# Altium schematic sheet ProstheticController.SchDoc
size A
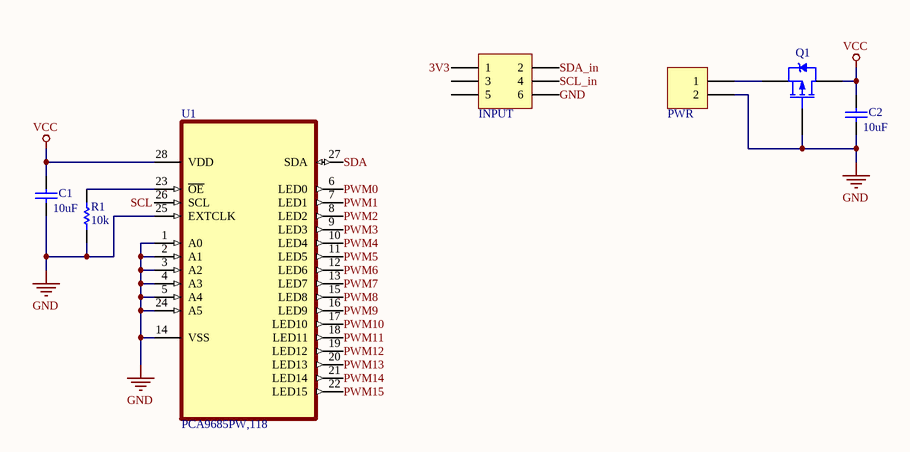
[diagram p0: ProstheticController.SchDoc]

## Parts
C1  10uF  [0805]
C2  10uF  [0805]
INPUT  90131-0123  [HDR2X3]  (value not drawn)
PWR  90120-0122  [HDR1X2]  (value not drawn)
Q1  FQP27P06  [TO-220]  (value not drawn)
R1  10k  [0805_RES_HD]
U1  PCA9685PW,118  [SOP65P640X110-28N]

## Nets
GND: C1.1 C2.1 INPUT.6 PWR.2 Q1.1(G) R1.1 U1.1(A0) U1.2(A1) U1.3(A2) U1.4(A3) U1.5(A4) U1.14(VSS) U1.24(A5) U1.25(EXTCLK)
VCC: C1.2 C2.2 Q1.2(D) U1.28(VDD)
3V3: INPUT.1
PWM0: U1.6(LED0)
PWM1: U1.7(LED1)
PWM2: U1.8(LED2)
PWM3: U1.9(LED3)
PWM4: U1.10(LED4)
PWM5: U1.11(LED5)
PWM6: U1.12(LED6)
PWM7: U1.13(LED7)
PWM8: U1.15(LED8)
PWM9: U1.16(LED9)
PWM10: U1.17(LED10)
PWM11: U1.18(LED11)
PWM12: U1.19(LED12)
PWM13: U1.20(LED13)
PWM14: U1.21(LED14)
PWM15: U1.22(LED15)
SCL: U1.26(SCL)
SCL_in: INPUT.4
SDA: U1.27(SDA)
SDA_in: INPUT.2
NetPWR_1: PWR.1 Q1.3(S)
NetR1_2: R1.2 U1.23(~{OE})

Not connected (* = marked no-connect by the designer): INPUT 3 5

## Library data of the parts
C1 C2 = CL21A475KPFNNNE: .1, 10%, 50V; Manufacturer 1: Samsung; GFUPartNo: CL21A475KPFNNNE; Manufacturer Part Number 1: CL21A475KPFNNNE; Part Type: SMT; PackageReference: 0805; Supplier 1: Digi-Key; Supplier Part Number 1: 1276-1259-1-ND
INPUT = 90131-0123: MOLEX CONN HEADER 6POS 2ROW .100" STR TIN; GFUPartNo: 90131-0123; Manufacturer 1: Molex; Manufacturer Part Number 1: 90131-0123; Part Type: THRU; Supplier 1: Digi-Key; Supplier Part Number 1: WM8121-ND
PWR = 90120-0122: MOLEX CONN HEADER 2POS .100" STR TIN; GFUPartNo: 90120-0122; Manufacturer 1: Molex; Manufacturer Part Number 1: 90120-0122; Part Type: THRU; Supplier 1: Digi-Key; Supplier Part Number 1: WM8072-ND
Q1 = FQP27P06: MOSFET P-CH 60V 27A TO-220; Manufacturer 1: Fairchild Semiconductor; GFUPartNo: FQP27P06; Manufacturer Part Number 1: FQP27P06; Part Type: THRU; PackageReference: TO-220; Supplier 1: Digi-Key; Supplier Part Number 1: FQP27P06-ND
R1 = RC2012F752CS: RES 10K OHM 1/8W 5% 0805; Manufacturer 1: Samsung; GFUPartNo: RC2012F752CS; Manufacturer Part Number 1: RC2012F752CS; Part Type: SMT; Supplier 1: Digi-Key; Supplier Part Number 1: 1276-5324-1-ND
U1 = PCA9685PW,118: LED Driver IC 16 Output Linear PWM Dimming 25mA 28-TSSOP; MF: NXP USA; Package: TSSOP-28 NXP Semiconductors; MP: PCA9685PW,118; Value: *; SnapEDA_Link: https://www.snapeda.com/parts/PCA9685PW%2C118/NXP%20USA%20Inc./view-part/1041520/?ref=snap; Digi-Key_Purchase_URL: https://www.digikey.in/product-detail/en/nxp-usa-inc/PCA9685PW,118/568-11925-1-ND/5221902?utm_source=snapeda&utm_medium=aggregator&utm_campaign=symbol; Digi-Key_Part_Number: 568-11925-1-ND